# EAGLE board protestSign (EAGLE 6.4), part 1 of 2
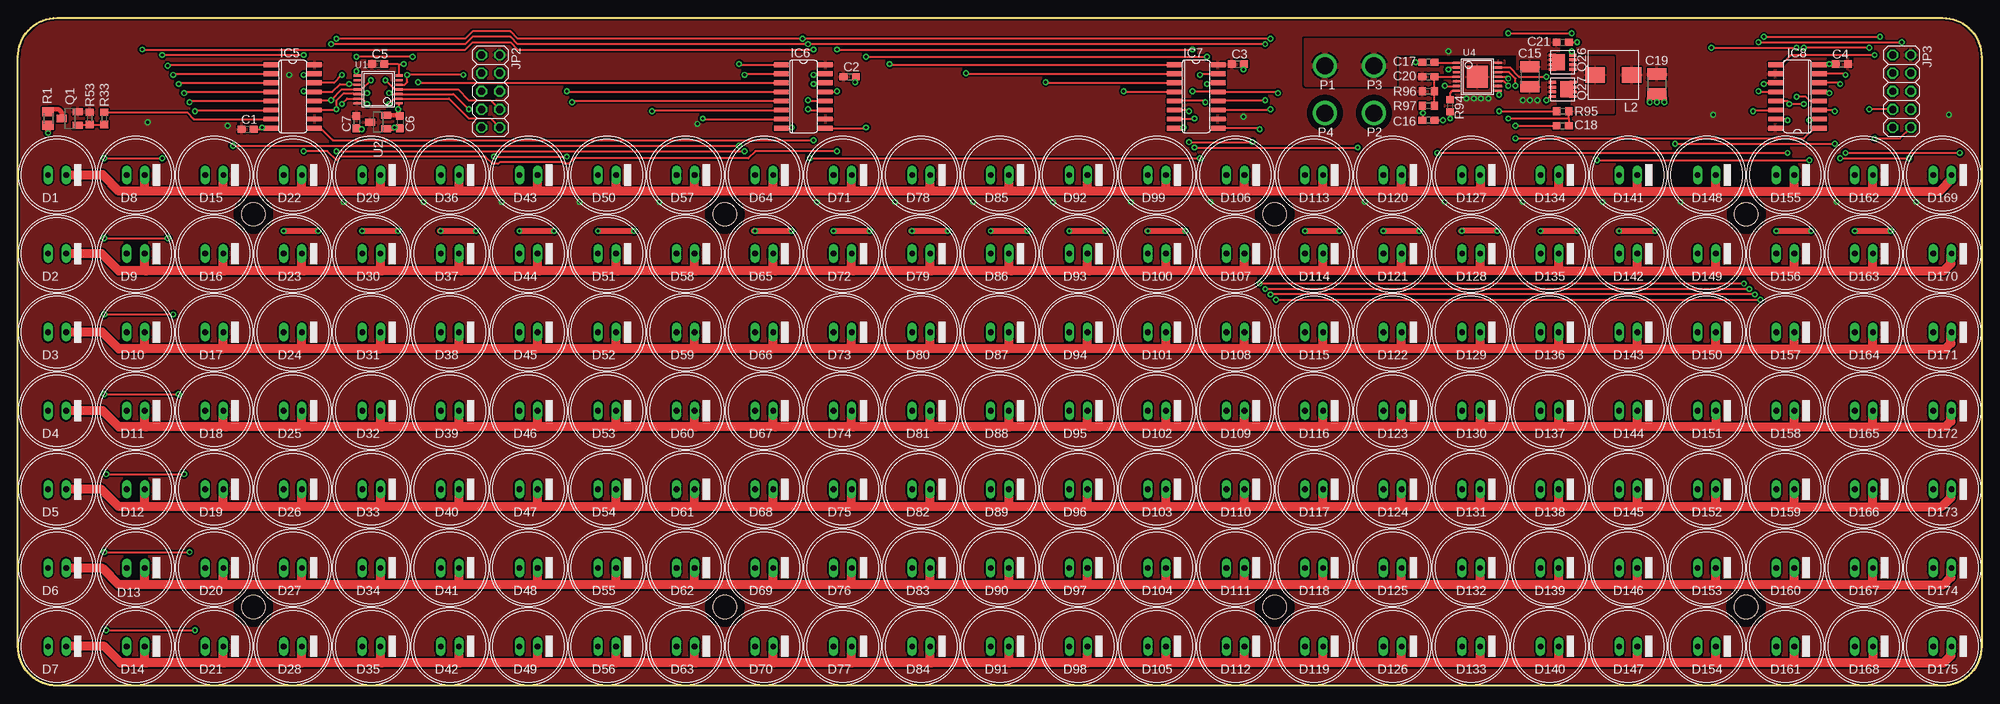
[diagram p5: board, top side]
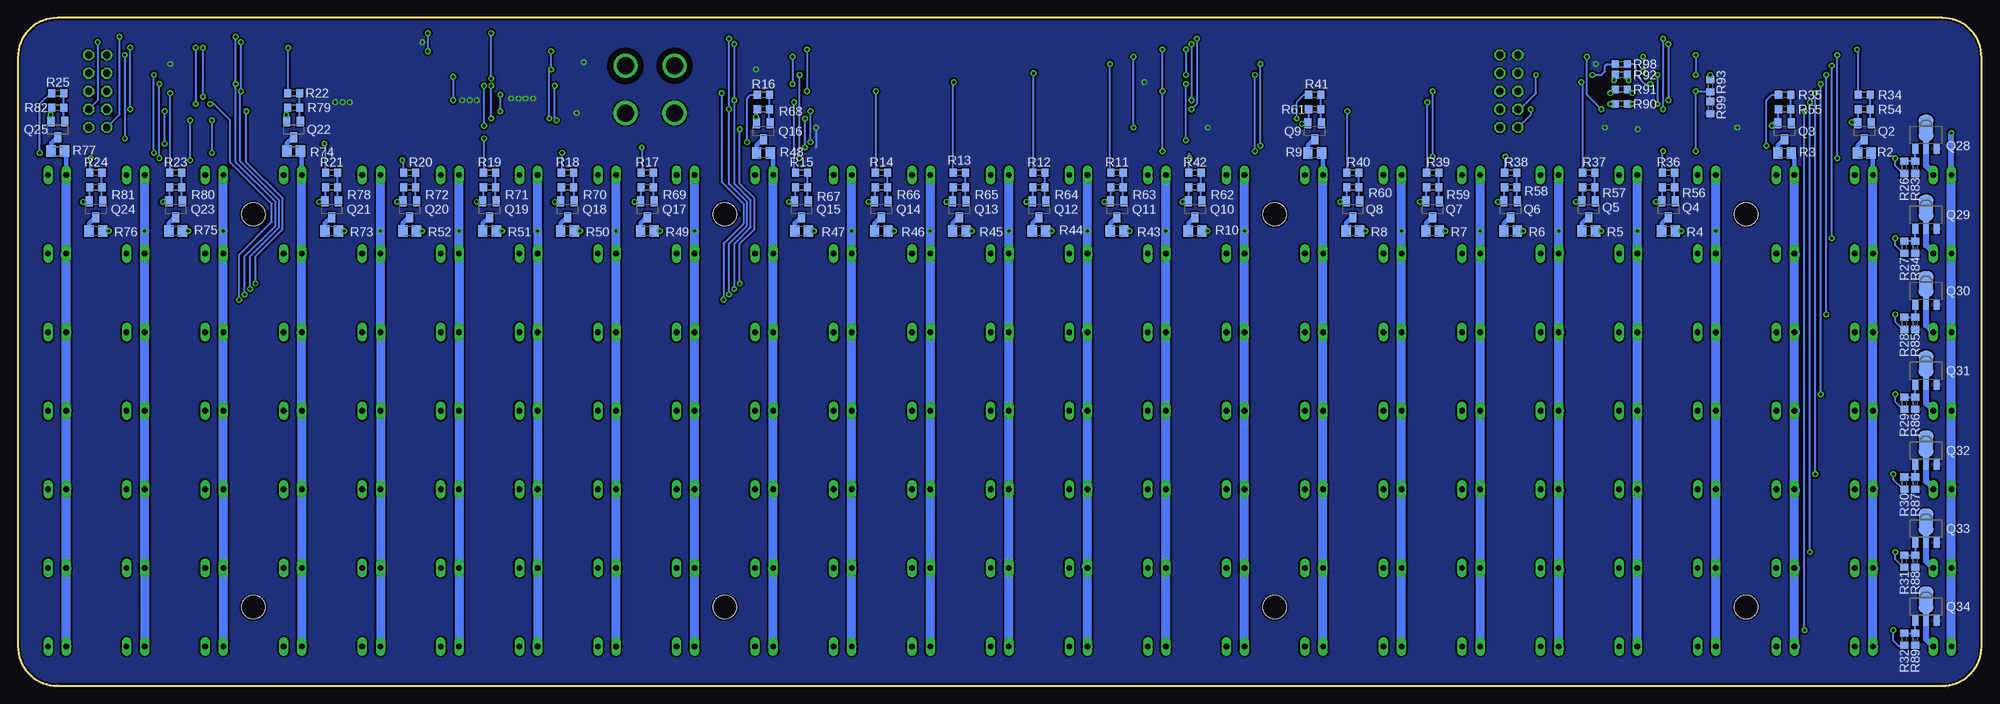
[diagram p6: board, bottom side, seen from below]

Size 275 x 93.5 mm. Coordinates in mm from the lower left corner, seen from the top.
Outline: 0,88 arc-90 5.5,93.5 269.5,93.5 arc-90 275,88 275,5.5 arc-90 269.5,0 5.5,0 arc-90 0,5.5 0,88
Copper layers (1*16): Top 0.0356mm / dielectric 0.2007mm / Bottom 0.0356mm
Design rules "PCBExpress_E2": minimum track width 6mil, minimum drill 16mil, track to track 6mil, track to pad 6mil, pad to pad 6mil, via to via 6mil, smd to smd 0mil, copper to edge 10mil, drill to drill 8mil, minimum pad ring 10mil, minimum via ring 8mil, stop-mask expansion 4mil, vias tented up to drill 16mil, thermal gap 10mil
Holes 3.3 mm at 33,11 242,11 99,11 176,11 33,66 99,66 176,66 242,66
tRestrict: area 30.5,63.5 to 35.5,68.5; area 30.5,8.5 to 35.5,13.5; area 96.5,8.5 to 101.5,13.5; area 96.5,63.5 to 101.5,68.5; area 173.5,63.5 to 178.5,68.5; area 173.5,8.5 to 178.5,13.5; area 239.5,8.5 to 244.5,13.5; area 180.8,77.9 to 185.3,82.5; area 187.6,77.9 to 192.2,82.5; area 239.5,63.5 to 244.5,68.5
bRestrict: area 180.8,84.5 to 185.3,89.1; area 187.6,84.5 to 192.2,89.1

## Footprints (pad centres in the part's own frame; a part is rotated, then mirrored left to right if it is on the bottom)
C0603 = smd 1.1 x 1: 1 -0.85,0; 2 0.85,0
C1210 = smd 1.6 x 2.7: 1 -1.4,0; 2 1.4,0
LED_10MM = drill 0.8 long: A -1.27,0; C 1.27,0
SO16 = smd 0.66 x 2.032: 1 -4.445,-3.073; 2 -3.175,-3.073; 3 -1.905,-3.073; 4 -0.635,-3.073; 5 0.635,-3.073; 6 1.905,-3.073; 7 3.175,-3.073; 8 4.445,-3.073; 9 4.445,3.073; 10 3.175,3.073; 11 1.905,3.073; 12 0.635,3.073; 13 -0.635,3.073; 14 -1.905,3.073; 15 -3.175,3.073; 16 -4.445,3.073
2X05 = drill 1.016 octagon: 1 -5.08,-1.27; 2 -5.08,1.27; 3 -2.54,-1.27; 4 -2.54,1.27; 5 0,-1.27; 6 0,1.27; 7 2.54,-1.27; 8 2.54,1.27; 9 5.08,-1.27; 10 5.08,1.27
744311150 = smd 2.7 x 2.2: P$1 -2.55,0; P$2 2.55,0
18AWG_TH = drill 2.381: 1 0,0
SOT23 = smd 1 x 1.4: 1 -0.95,-1.1; 2 0.95,-1.1; 3 0,1.1
POWERPAK_1212_8 = smd 0.991 x 0.406: D1 1.435,0.991; D2 1.435,0.33; D3 1.435,-0.33; D4 1.435,-0.991; G -1.435,-0.991; S1 -1.435,0.991; S2 -1.435,0.33; S3 -1.435,-0.33 | smd 1.727 x 2.235: D5 0.559,0
SOT89 = smd 0.8 x 1.4: 1 -1.499,-1.981; 3 1.499,-1.981 | smd 0.8 x 1.9: 2 0,-1.727 | smd 2.032 x 3.65: 2@1 0,0.94
M0805 = smd 1.3 x 1.6: 1 -0.95,0; 2 0.95,0
R0603 = smd 1 x 1.1: 1 -0.85,0; 2 0.85,0
TSSOP14 = smd 0.305 x 0.991: 1 -1.95,-2.918; 2 -1.3,-2.918; 3 -0.65,-2.918; 4 0,-2.918; 5 0.65,-2.918; 6 1.3,-2.918; 7 1.95,-2.918; 8 1.95,2.918; 9 1.3,2.918; 10 0.65,2.918; 11 0,2.918; 12 -0.65,2.918; 13 -1.3,2.918; 14 -1.95,2.918
TSSOP14_EP = smd 0.305 x 0.991: 1 -1.95,-2.918; 2 -1.3,-2.918; 3 -0.65,-2.918; 4 0,-2.918; 5 0.65,-2.918; 6 1.3,-2.918; 7 1.95,-2.918; 8 1.95,2.918; 9 1.3,2.918; 10 0.65,2.918; 11 0,2.918; 12 -0.65,2.918; 13 -1.3,2.918; 14 -1.95,2.918 | smd 3.1 x 3: EP 0,0

## Placement (x,y rotation side)
C1  0.1UF  [C0603]  32.17,77.89 0 top
C2  0.1UF  [C0603]  116.5,85.26 0 top
C3  0.1UF  [C0603]  170.85,87.03 0 top
C4  0.1UF  [C0603]  255.44,87.03 180 top
C5  0.1UF  [C0603]  50.46,87.03 0 top
C6  1UF  [C0603]  53.51,78.91 270 top
C7  1UF  [C0603]  47.41,78.91 270 top
C15  10UF  [C1210]  211.75,85.26 270 top
C16  0.015UF  [C0603]  197.52,79.16 180 top
C17  1UF  [C0603]  197.52,87.29 180 top
C18  0.47UF  [C0603]  216.32,78.4 0 top
C19  47UF  [C1210]  229.53,84.24 270 top
C20  220PF  [C0603]  197.52,85.26 0 top
C21  0.1UF  [C0603]  216.32,90.08 0 top
D1  10MM  [LED_10MM]  5.5,71.5 0 top
D2  10MM  [LED_10MM]  5.5,60.5 0 top
D3  10MM  [LED_10MM]  5.5,49.5 0 top
D4  10MM  [LED_10MM]  5.5,38.5 0 top
D5  10MM  [LED_10MM]  5.5,27.5 0 top
D6  10MM  [LED_10MM]  5.5,16.5 0 top
D7  10MM  [LED_10MM]  5.5,5.5 0 top
D8  10MM  [LED_10MM]  16.5,71.5 0 top
D9  10MM  [LED_10MM]  16.5,60.5 0 top
D10  10MM  [LED_10MM]  16.5,49.5 0 top
D11  10MM  [LED_10MM]  16.5,38.5 0 top
D12  10MM  [LED_10MM]  16.5,27.5 0 top
D13  10MM  [LED_10MM]  16.5,16.5 0 top
D14  10MM  [LED_10MM]  16.5,5.5 0 top
D15  10MM  [LED_10MM]  27.5,71.5 0 top
D16  10MM  [LED_10MM]  27.5,60.5 0 top
D17  10MM  [LED_10MM]  27.5,49.5 0 top
D18  10MM  [LED_10MM]  27.5,38.5 0 top
D19  10MM  [LED_10MM]  27.5,27.5 0 top
D20  10MM  [LED_10MM]  27.5,16.5 0 top
D21  10MM  [LED_10MM]  27.5,5.5 0 top
D22  10MM  [LED_10MM]  38.5,71.5 0 top
D23  10MM  [LED_10MM]  38.5,60.5 0 top
D24  10MM  [LED_10MM]  38.5,49.5 0 top
D25  10MM  [LED_10MM]  38.5,38.5 0 top
D26  10MM  [LED_10MM]  38.5,27.5 0 top
D27  10MM  [LED_10MM]  38.5,16.5 0 top
D28  10MM  [LED_10MM]  38.5,5.5 0 top
D29  10MM  [LED_10MM]  49.5,71.5 0 top
D30  10MM  [LED_10MM]  49.5,60.5 0 top
D31  10MM  [LED_10MM]  49.5,49.5 0 top
D32  10MM  [LED_10MM]  49.5,38.5 0 top
D33  10MM  [LED_10MM]  49.5,27.5 0 top
D34  10MM  [LED_10MM]  49.5,16.5 0 top
D35  10MM  [LED_10MM]  49.5,5.5 0 top
D36  10MM  [LED_10MM]  60.5,71.5 0 top
D37  10MM  [LED_10MM]  60.5,60.5 0 top
D38  10MM  [LED_10MM]  60.5,49.5 0 top
D39  10MM  [LED_10MM]  60.5,38.5 0 top
D40  10MM  [LED_10MM]  60.5,27.5 0 top
D41  10MM  [LED_10MM]  60.5,16.5 0 top
D42  10MM  [LED_10MM]  60.5,5.5 0 top
D43  10MM  [LED_10MM]  71.5,71.5 0 top
D44  10MM  [LED_10MM]  71.5,60.5 0 top
D45  10MM  [LED_10MM]  71.5,49.5 0 top
D46  10MM  [LED_10MM]  71.5,38.5 0 top
D47  10MM  [LED_10MM]  71.5,27.5 0 top
D48  10MM  [LED_10MM]  71.5,16.5 0 top
D49  10MM  [LED_10MM]  71.5,5.5 0 top
D50  10MM  [LED_10MM]  82.5,71.5 0 top
D51  10MM  [LED_10MM]  82.5,60.5 0 top
D52  10MM  [LED_10MM]  82.5,49.5 0 top
D53  10MM  [LED_10MM]  82.5,38.5 0 top
D54  10MM  [LED_10MM]  82.5,27.5 0 top
D55  10MM  [LED_10MM]  82.5,16.5 0 top
D56  10MM  [LED_10MM]  82.5,5.5 0 top
D57  10MM  [LED_10MM]  93.5,71.5 0 top
D58  10MM  [LED_10MM]  93.5,60.5 0 top
D59  10MM  [LED_10MM]  93.5,49.5 0 top
D60  10MM  [LED_10MM]  93.5,38.5 0 top
D61  10MM  [LED_10MM]  93.5,27.5 0 top
D62  10MM  [LED_10MM]  93.5,16.5 0 top
D63  10MM  [LED_10MM]  93.5,5.5 0 top
D64  10MM  [LED_10MM]  104.5,71.5 0 top
D65  10MM  [LED_10MM]  104.5,60.5 0 top
D66  10MM  [LED_10MM]  104.5,49.5 0 top
D67  10MM  [LED_10MM]  104.5,38.5 0 top
D68  10MM  [LED_10MM]  104.5,27.5 0 top
D69  10MM  [LED_10MM]  104.5,16.5 0 top
D70  10MM  [LED_10MM]  104.5,5.5 0 top
D71  10MM  [LED_10MM]  115.5,71.5 0 top
D72  10MM  [LED_10MM]  115.5,60.5 0 top
D73  10MM  [LED_10MM]  115.5,49.5 0 top
D74  10MM  [LED_10MM]  115.5,38.5 0 top
D75  10MM  [LED_10MM]  115.5,27.5 0 top
D76  10MM  [LED_10MM]  115.5,16.5 0 top
D77  10MM  [LED_10MM]  115.5,5.5 0 top
D78  10MM  [LED_10MM]  126.5,71.5 0 top
D79  10MM  [LED_10MM]  126.5,60.5 0 top
D80  10MM  [LED_10MM]  126.5,49.5 0 top
D81  10MM  [LED_10MM]  126.5,38.5 0 top
D82  10MM  [LED_10MM]  126.5,27.5 0 top
D83  10MM  [LED_10MM]  126.5,16.5 0 top
D84  10MM  [LED_10MM]  126.5,5.5 0 top
D85  10MM  [LED_10MM]  137.5,71.5 0 top
D86  10MM  [LED_10MM]  137.5,60.5 0 top
D87  10MM  [LED_10MM]  137.5,49.5 0 top
D88  10MM  [LED_10MM]  137.5,38.5 0 top
D89  10MM  [LED_10MM]  137.5,27.5 0 top
D90  10MM  [LED_10MM]  137.5,16.5 0 top
D91  10MM  [LED_10MM]  137.5,5.5 0 top
D92  10MM  [LED_10MM]  148.5,71.5 0 top
D93  10MM  [LED_10MM]  148.5,60.5 0 top
D94  10MM  [LED_10MM]  148.5,49.5 0 top
D95  10MM  [LED_10MM]  148.5,38.5 0 top
D96  10MM  [LED_10MM]  148.5,27.5 0 top
D97  10MM  [LED_10MM]  148.5,16.5 0 top
D98  10MM  [LED_10MM]  148.5,5.5 0 top
D99  10MM  [LED_10MM]  159.5,71.5 0 top
D100  10MM  [LED_10MM]  159.5,60.5 0 top
D101  10MM  [LED_10MM]  159.5,49.5 0 top
D102  10MM  [LED_10MM]  159.5,38.5 0 top
D103  10MM  [LED_10MM]  159.5,27.5 0 top
D104  10MM  [LED_10MM]  159.5,16.5 0 top
D105  10MM  [LED_10MM]  159.5,5.5 0 top
D106  10MM  [LED_10MM]  170.5,71.5 0 top
D107  10MM  [LED_10MM]  170.5,60.5 0 top
D108  10MM  [LED_10MM]  170.5,49.5 0 top
D109  10MM  [LED_10MM]  170.5,38.5 0 top
D110  10MM  [LED_10MM]  170.5,27.5 0 top
D111  10MM  [LED_10MM]  170.5,16.5 0 top
D112  10MM  [LED_10MM]  170.5,5.5 0 top
D113  10MM  [LED_10MM]  181.5,71.5 0 top
D114  10MM  [LED_10MM]  181.5,60.5 0 top
D115  10MM  [LED_10MM]  181.5,49.5 0 top
D116  10MM  [LED_10MM]  181.5,38.5 0 top
D117  10MM  [LED_10MM]  181.5,27.5 0 top
D118  10MM  [LED_10MM]  181.5,16.5 0 top
D119  10MM  [LED_10MM]  181.5,5.5 0 top
D120  10MM  [LED_10MM]  192.5,71.5 0 top
D121  10MM  [LED_10MM]  192.5,60.5 0 top
D122  10MM  [LED_10MM]  192.5,49.5 0 top
D123  10MM  [LED_10MM]  192.5,38.5 0 top
D124  10MM  [LED_10MM]  192.5,27.5 0 top
D125  10MM  [LED_10MM]  192.5,16.5 0 top
D126  10MM  [LED_10MM]  192.5,5.5 0 top
D127  10MM  [LED_10MM]  203.5,71.5 0 top
D128  10MM  [LED_10MM]  203.5,60.5 0 top
D129  10MM  [LED_10MM]  203.5,49.5 0 top
D130  10MM  [LED_10MM]  203.5,38.5 0 top
D131  10MM  [LED_10MM]  203.5,27.5 0 top
D132  10MM  [LED_10MM]  203.5,16.5 0 top
D133  10MM  [LED_10MM]  203.5,5.5 0 top
D134  10MM  [LED_10MM]  214.5,71.5 0 top
D135  10MM  [LED_10MM]  214.5,60.5 0 top
D136  10MM  [LED_10MM]  214.5,49.5 0 top
D137  10MM  [LED_10MM]  214.5,38.5 0 top
D138  10MM  [LED_10MM]  214.5,27.5 0 top
D139  10MM  [LED_10MM]  214.5,16.5 0 top
D140  10MM  [LED_10MM]  214.5,5.5 0 top
D141  10MM  [LED_10MM]  225.5,71.5 0 top
D142  10MM  [LED_10MM]  225.5,60.5 0 top
D143  10MM  [LED_10MM]  225.5,49.5 0 top
D144  10MM  [LED_10MM]  225.5,38.5 0 top
D145  10MM  [LED_10MM]  225.5,27.5 0 top
D146  10MM  [LED_10MM]  225.5,16.5 0 top
D147  10MM  [LED_10MM]  225.5,5.5 0 top
D148  10MM  [LED_10MM]  236.5,71.5 0 top
D149  10MM  [LED_10MM]  236.5,60.5 0 top
D150  10MM  [LED_10MM]  236.5,49.5 0 top
D151  10MM  [LED_10MM]  236.5,38.5 0 top
D152  10MM  [LED_10MM]  236.5,27.5 0 top
D153  10MM  [LED_10MM]  236.5,16.5 0 top
D154  10MM  [LED_10MM]  236.5,5.5 0 top
D155  10MM  [LED_10MM]  247.5,71.5 0 top
D156  10MM  [LED_10MM]  247.5,60.5 0 top
D157  10MM  [LED_10MM]  247.5,49.5 0 top
D158  10MM  [LED_10MM]  247.5,38.5 0 top
D159  10MM  [LED_10MM]  247.5,27.5 0 top
D160  10MM  [LED_10MM]  247.5,16.5 0 top
D161  10MM  [LED_10MM]  247.5,5.5 0 top
D162  10MM  [LED_10MM]  258.5,71.5 0 top
D163  10MM  [LED_10MM]  258.5,60.5 0 top
D164  10MM  [LED_10MM]  258.5,49.5 0 top
D165  10MM  [LED_10MM]  258.5,38.5 0 top
D166  10MM  [LED_10MM]  258.5,27.5 0 top
D167  10MM  [LED_10MM]  258.5,16.5 0 top
D168  10MM  [LED_10MM]  258.5,5.5 0 top
D169  10MM  [LED_10MM]  269.5,71.5 0 top
D170  10MM  [LED_10MM]  269.5,60.5 0 top
D171  10MM  [LED_10MM]  269.5,49.5 0 top
D172  10MM  [LED_10MM]  269.5,38.5 0 top
D173  10MM  [LED_10MM]  269.5,27.5 0 top
D174  10MM  [LED_10MM]  269.5,16.5 0 top
D175  10MM  [LED_10MM]  269.5,5.5 0 top
IC5  74LS595D  [SO16]  38.49,82.5 270 top
IC6  74LS595D  [SO16]  110,82.5 270 top
IC7  74LS595D  [SO16]  165,82.5 270 top
IC8  74LS595D  [SO16]  249.21,82.5 90 top
JP2  [2X05]  66.21,83.22 90 top
JP3  [2X05]  263.82,83.22 90 top
L2  744311150  [744311150]  223.43,85.51 0 top
P1  THROUGH_HOLE18AWG  [18AWG_TH]  183.05,86.78 0 top
P2  THROUGH_HOLE18AWG  [18AWG_TH]  189.9,80.18 0 top
P3  THROUGH_HOLE18AWG  [18AWG_TH]  189.9,86.78 0 top
P4  THROUGH_HOLE18AWG  [18AWG_TH]  183.05,80.18 0 top
Q1  SI2319DS  [SOT23]  7.28,79.41 90 top
Q2  SI2319DS  [SOT23]  16.42,77.64 180 bottom
Q3  SI2319DS  [SOT23]  27.6,77.64 180 bottom
Q4  SI2319DS  [SOT23]  43.85,66.71 180 bottom
Q5  SI2319DS  [SOT23]  55.03,66.71 180 bottom
Q6  SI2319DS  [SOT23]  65.95,66.71 180 bottom
Q7  SI2319DS  [SOT23]  76.87,66.71 180 bottom
Q8  SI2319DS  [SOT23]  88.05,66.71 180 bottom
Q9  SI2319DS  [SOT23]  93.38,77.64 180 bottom
Q10  SI2319DS  [SOT23]  110.15,66.71 180 bottom
Q11  SI2319DS  [SOT23]  121.07,66.71 180 bottom
Q12  SI2319DS  [SOT23]  131.99,66.71 180 bottom
Q13  SI2319DS  [SOT23]  143.17,66.71 180 bottom
Q14  SI2319DS  [SOT23]  154.09,66.71 180 bottom
Q15  SI2319DS  [SOT23]  165.27,66.71 180 bottom
Q16  SI2319DS  [SOT23]  170.6,77.64 180 bottom
Q17  SI2319DS  [SOT23]  186.86,66.71 180 bottom
Q18  SI2319DS  [SOT23]  198.03,66.71 180 bottom
Q19  SI2319DS  [SOT23]  208.95,66.71 180 bottom
Q20  SI2319DS  [SOT23]  220.13,66.71 180 bottom
Q21  SI2319DS  [SOT23]  231.05,66.71 180 bottom
Q22  SI2319DS  [SOT23]  236.39,77.89 180 bottom
Q23  SI2319DS  [SOT23]  252.9,66.71 180 bottom
Q24  SI2319DS  [SOT23]  264.07,66.71 180 bottom
Q25  SI2319DS  [SOT23]  269.41,77.89 180 bottom
Q26  SI7718DN  [POWERPAK_1212_8]  216.32,87.29 180 top
Q27  SI7718DN  [POWERPAK_1212_8]  216.32,83.48 0 top
Q28  ZXMN6A11ZTA  [SOT89]  7.79,77.13 0 bottom
Q29  ZXMN6A11ZTA  [SOT89]  7.79,65.95 0 bottom
Q30  ZXMN6A11ZTA  [SOT89]  7.79,55.28 0 bottom
Q31  ZXMN6A11ZTA  [SOT89]  7.79,44.11 0 bottom
Q32  ZXMN6A11ZTA  [SOT89]  7.79,32.93 0 bottom
Q33  ZXMN6A11ZTA  [SOT89]  7.79,22.01 0 bottom
Q34  ZXMN6A11ZTA  [SOT89]  7.79,11.09 0 bottom
R1  150  [M0805]  4.23,79.41 90 top
R2  150  [M0805]  16.42,74.59 180 bottom
R3  150  [M0805]  27.6,74.59 180 bottom
R4  150  [M0805]  43.85,63.67 180 bottom
R5  150  [M0805]  55.03,63.67 180 bottom
R6  150  [M0805]  65.95,63.67 180 bottom
R7  150  [M0805]  76.87,63.67 180 bottom
R8  150  [M0805]  88.05,63.67 180 bottom
R9  150  [M0805]  93.38,74.59 180 bottom
R10  150  [M0805]  110.15,63.67 180 bottom
R11  100  [R0603]  121.07,71.79 0 bottom
R12  100  [R0603]  131.99,71.79 0 bottom
R13  100  [R0603]  143.17,71.79 0 bottom
R14  100  [R0603]  154.09,71.79 0 bottom
R15  100  [R0603]  165.27,71.79 0 bottom
R16  100  [R0603]  170.6,82.72 0 bottom
R17  100  [R0603]  186.86,71.79 0 bottom
R18  100  [R0603]  198.03,71.79 0 bottom
R19  100  [R0603]  208.95,71.79 0 bottom
R20  100  [R0603]  220.13,71.79 0 bottom
R21  100  [R0603]  231.05,71.79 0 bottom
R22  100  [R0603]  236.39,82.97 0 bottom
R23  100  [R0603]  252.9,71.79 0 bottom
R24  100  [R0603]  264.07,71.79 0 bottom
R25  100  [R0603]  269.41,82.97 0 bottom
R26  100  [R0603]  10.83,72.56 270 bottom
R27  100  [R0603]  10.83,61.38 270 bottom
R28  100  [R0603]  10.83,50.71 270 bottom
R29  100  [R0603]  10.83,39.54 270 bottom
R30  100  [R0603]  10.83,28.36 270 bottom
R31  100  [R0603]  10.83,17.44 270 bottom
R32  100  [R0603]  10.83,6.52 270 bottom
R33  100  [R0603]  12.1,79.41 270 top
R34  100  [R0603]  16.42,82.72 0 bottom
R35  100  [R0603]  27.6,82.72 0 bottom
R36  100  [R0603]  43.85,71.79 0 bottom
R37  100  [R0603]  55.03,71.79 0 bottom
R38  100  [R0603]  65.95,71.79 0 bottom
R39  100  [R0603]  76.87,71.79 0 bottom
R40  100  [R0603]  88.05,71.79 0 bottom
R41  100  [R0603]  93.38,82.72 0 bottom
R42  100  [R0603]  110.15,71.79 0 bottom
R43  150  [M0805]  121.07,63.67 180 bottom
R44  150  [M0805]  131.99,63.67 180 bottom
R45  150  [M0805]  143.17,63.67 180 bottom
R46  150  [M0805]  154.09,63.67 180 bottom
R47  150  [M0805]  165.27,63.67 180 bottom
R48  150  [M0805]  170.6,74.59 180 bottom
R49  150  [M0805]  186.86,63.67 180 bottom
R50  150  [M0805]  198.03,63.67 180 bottom
R51  150  [M0805]  208.95,63.67 180 bottom
R52  150  [M0805]  220.13,63.67 180 bottom
R53  10K  [R0603]  10.07,79.41 90 top
R54  10K  [R0603]  16.42,80.68 180 bottom
R55  10K  [R0603]  27.6,80.68 180 bottom
R56  10K  [R0603]  43.85,69.76 180 bottom
R57  10K  [R0603]  55.03,69.76 180 bottom
R58  10K  [R0603]  65.95,69.76 180 bottom
R59  10K  [R0603]  76.87,69.76 180 bottom
R60  10K  [R0603]  88.05,69.76 180 bottom
R61  10K  [R0603]  93.38,80.68 180 bottom
R62  10K  [R0603]  110.15,69.76 180 bottom
R63  10K  [R0603]  121.07,69.76 180 bottom
R64  10K  [R0603]  131.99,69.76 180 bottom
R65  10K  [R0603]  143.17,69.76 180 bottom
R66  10K  [R0603]  154.09,69.76 180 bottom
R67  10K  [R0603]  165.27,69.76 180 bottom
R68  10K  [R0603]  170.6,80.68 180 bottom
R69  10K  [R0603]  186.86,69.76 180 bottom
R70  10K  [R0603]  198.03,69.76 180 bottom
R71  10K  [R0603]  208.95,69.76 180 bottom
R72  10K  [R0603]  220.13,69.76 180 bottom
R73  150  [M0805]  231.05,63.67 180 bottom
R74  150  [M0805]  236.39,74.84 180 bottom
R75  150  [M0805]  252.9,63.67 180 bottom
R76  150  [M0805]  264.07,63.67 180 bottom
R77  150  [M0805]  269.41,74.84 180 bottom
R78  10K  [R0603]  231.05,69.76 180 bottom
R79  10K  [R0603]  236.39,80.94 180 bottom
R80  10K  [R0603]  252.9,69.76 180 bottom
R81  10K  [R0603]  264.07,69.76 180 bottom
R82  10K  [R0603]  269.41,80.94 180 bottom
R83  10K  [R0603]  9.31,72.56 270 bottom
R84  10K  [R0603]  9.31,61.38 270 bottom
R85  10K  [R0603]  9.31,50.71 270 bottom
R86  10K  [R0603]  9.31,39.54 270 bottom
R87  10K  [R0603]  9.31,28.36 270 bottom
R88  10K  [R0603]  9.31,17.44 270 bottom
R89  10K  [R0603]  9.31,6.52 270 bottom
R90  NL  [R0603]  50.46,81.45 0 bottom
R91  NL  [R0603]  50.46,83.48 0 bottom
R92  NL  [R0603]  50.46,85.51 0 bottom
R93  1K  [R0603]  38.01,83.99 270 bottom
R94  32.4K  [R0603]  200.57,81.19 270 top
R95  1.87K  [R0603]  216.32,80.43 180 top
R96  60.4K  [R0603]  197.52,83.22 180 top
R97  10K  [R0603]  197.52,81.19 0 top
R98  NL  [R0603]  50.46,87.03 0 bottom
R99  NL  [R0603]  38.01,80.94 270 bottom
U1  TXB0104PW  [TSSOP14]  50.46,83.48 90 top
U2  MCP1703T-3302E/CB  [SOT23]  50.46,78.91 90 top
U4  LM3150MH  [TSSOP14_EP]  204.38,85.26 270 top